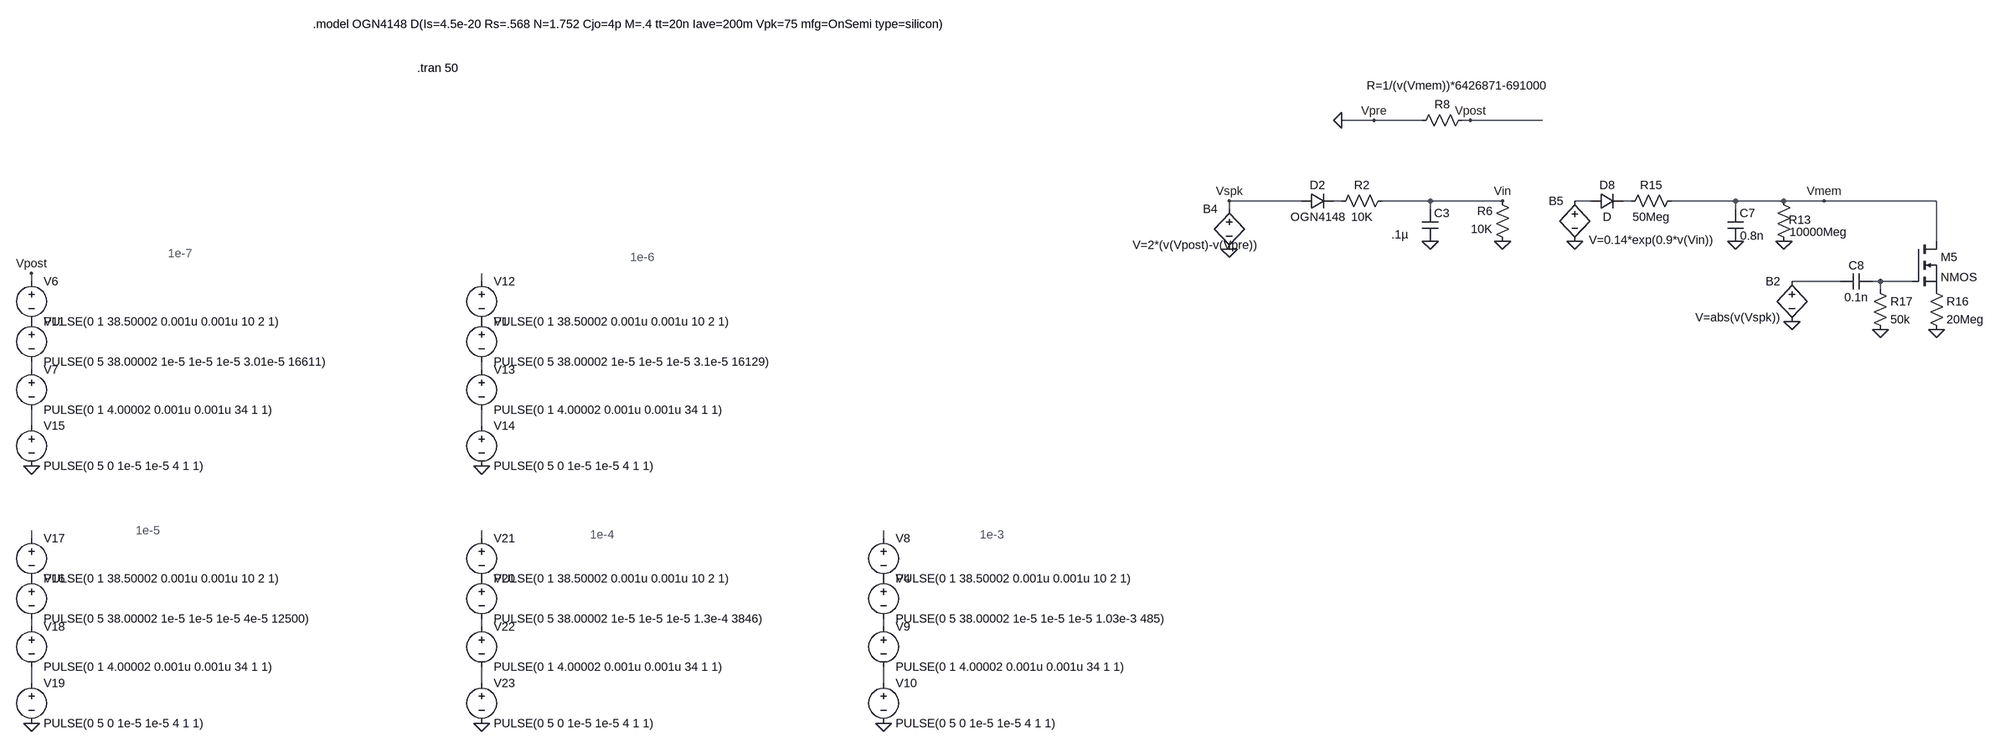
[diagram p0: schematic Synapse_Response.asc]
Synapse_Response.asc, the LTspice schematic file:
Version 4
SHEET 1 2980 2052
WIRE 240 416 176 416
WIRE 336 416 240 416
WIRE 432 416 416 416
WIRE 576 416 432 416
WIRE 96 640 -48 640
WIRE 176 640 160 640
WIRE 352 640 256 640
WIRE 496 640 352 640
WIRE 672 640 640 640
WIRE 752 640 736 640
WIRE 960 640 832 640
WIRE 1056 640 960 640
WIRE 1136 640 1056 640
WIRE 1360 640 1136 640
WIRE -48 656 -48 640
WIRE 352 656 352 640
WIRE 960 656 960 640
WIRE 1360 720 1360 640
WIRE -2432 800 -2432 784
WIRE -1536 800 -1536 784
WIRE 1168 800 1072 800
WIRE 1248 800 1232 800
WIRE 1312 800 1248 800
WIRE 1248 816 1248 800
WIRE -2432 976 -2432 960
WIRE -1536 976 -1536 960
WIRE -2432 1088 -2432 1056
WIRE -1536 1088 -1536 1056
WIRE -2432 1312 -2432 1296
WIRE -1536 1312 -1536 1296
WIRE -736 1312 -736 1296
WIRE -2432 1488 -2432 1472
WIRE -1536 1488 -1536 1472
WIRE -736 1488 -736 1472
WIRE -2432 1600 -2432 1568
WIRE -1536 1600 -1536 1568
WIRE -736 1600 -736 1568
FLAG -48 736 0
FLAG 432 416 Vpost
FLAG 352 720 0
FLAG 496 720 0
FLAG -736 1680 0
FLAG 496 640 Vin
FLAG -2432 1168 0
FLAG -48 640 Vspk
FLAG 176 416 0
FLAG -2432 784 Vpost
FLAG 240 416 Vpre
FLAG -1536 1168 0
FLAG -2432 1680 0
FLAG -1536 1680 0
FLAG 1072 880 0
FLAG 1056 720 0
FLAG 960 720 0
FLAG 640 720 0
FLAG 1360 896 0
FLAG 1248 896 0
FLAG 1136 640 Vmem
SYMBOL res 512 736 R180
WINDOW 0 36 76 Left 2
WINDOW 3 36 40 Left 2
SYMATTR InstName R6
SYMATTR Value 10K
SYMBOL bv -48 640 R0
WINDOW 0 -52 16 Left 2
WINDOW 3 -192 88 Left 2
SYMATTR InstName B4
SYMATTR Value V=2*(v(Vpost)-v(Vpre))
SYMBOL res 432 400 R90
WINDOW 0 0 56 VBottom 2
WINDOW 3 -69 27 VTop 2
SYMATTR InstName R8
SYMATTR Value R=1/(v(Vmem))*6426871-691000
SYMBOL cap 336 656 R0
WINDOW 3 -61 51 Left 2
SYMATTR Value .1µ
SYMATTR InstName C3
SYMATTR SpiceLine V=16 Irms=7.41 Rser=0.000 Lser=0
SYMBOL voltage -736 1376 R0
WINDOW 123 0 0 Left 2
WINDOW 39 0 0 Left 2
SYMATTR InstName V4
SYMATTR Value PULSE(0 5 38.00002 1e-5 1e-5 1e-5 1.03e-3 485)
SYMBOL voltage -736 1296 R0
WINDOW 123 0 0 Left 2
WINDOW 39 0 0 Left 2
SYMATTR InstName V8
SYMATTR Value PULSE(0 1 38.50002 0.001u 0.001u 10 2 1)
SYMBOL voltage -736 1472 R0
WINDOW 123 0 0 Left 2
WINDOW 39 0 0 Left 2
SYMATTR InstName V9
SYMATTR Value PULSE(0 1 4.00002 0.001u 0.001u 34 1 1)
SYMBOL voltage -736 1584 R0
WINDOW 123 0 0 Left 2
WINDOW 39 0 0 Left 2
SYMATTR InstName V10
SYMATTR Value PULSE(0 5 0 1e-5 1e-5 4 1 1)
SYMBOL res 272 624 R90
WINDOW 0 0 56 VBottom 2
WINDOW 3 32 56 VTop 2
SYMATTR InstName R2
SYMATTR Value 10K
SYMBOL voltage -2432 864 R0
WINDOW 123 0 0 Left 2
WINDOW 39 0 0 Left 2
SYMATTR InstName V11
SYMATTR Value PULSE(0 5 38.00002 1e-5 1e-5 1e-5 3.01e-5 16611)
SYMBOL voltage -2432 784 R0
WINDOW 123 0 0 Left 2
WINDOW 39 0 0 Left 2
SYMATTR InstName V6
SYMATTR Value PULSE(0 1 38.50002 0.001u 0.001u 10 2 1)
SYMBOL voltage -2432 960 R0
WINDOW 123 0 0 Left 2
WINDOW 39 0 0 Left 2
SYMATTR InstName V7
SYMATTR Value PULSE(0 1 4.00002 0.001u 0.001u 34 1 1)
SYMBOL voltage -2432 1072 R0
WINDOW 123 0 0 Left 2
WINDOW 39 0 0 Left 2
SYMATTR InstName V15
SYMATTR Value PULSE(0 5 0 1e-5 1e-5 4 1 1)
SYMBOL voltage -1536 864 R0
WINDOW 123 0 0 Left 2
WINDOW 39 0 0 Left 2
SYMATTR InstName V1
SYMATTR Value PULSE(0 5 38.00002 1e-5 1e-5 1e-5 3.1e-5 16129)
SYMBOL voltage -1536 784 R0
WINDOW 123 0 0 Left 2
WINDOW 39 0 0 Left 2
SYMATTR InstName V12
SYMATTR Value PULSE(0 1 38.50002 0.001u 0.001u 10 2 1)
SYMBOL voltage -1536 960 R0
WINDOW 123 0 0 Left 2
WINDOW 39 0 0 Left 2
SYMATTR InstName V13
SYMATTR Value PULSE(0 1 4.00002 0.001u 0.001u 34 1 1)
SYMBOL voltage -1536 1072 R0
WINDOW 123 0 0 Left 2
WINDOW 39 0 0 Left 2
SYMATTR InstName V14
SYMATTR Value PULSE(0 5 0 1e-5 1e-5 4 1 1)
SYMBOL voltage -2432 1376 R0
WINDOW 123 0 0 Left 2
WINDOW 39 0 0 Left 2
SYMATTR InstName V16
SYMATTR Value PULSE(0 5 38.00002 1e-5 1e-5 1e-5 4e-5 12500)
SYMBOL voltage -2432 1296 R0
WINDOW 123 0 0 Left 2
WINDOW 39 0 0 Left 2
SYMATTR InstName V17
SYMATTR Value PULSE(0 1 38.50002 0.001u 0.001u 10 2 1)
SYMBOL voltage -2432 1472 R0
WINDOW 123 0 0 Left 2
WINDOW 39 0 0 Left 2
SYMATTR InstName V18
SYMATTR Value PULSE(0 1 4.00002 0.001u 0.001u 34 1 1)
SYMBOL voltage -2432 1584 R0
WINDOW 123 0 0 Left 2
WINDOW 39 0 0 Left 2
SYMATTR InstName V19
SYMATTR Value PULSE(0 5 0 1e-5 1e-5 4 1 1)
SYMBOL voltage -1536 1376 R0
WINDOW 123 0 0 Left 2
WINDOW 39 0 0 Left 2
SYMATTR InstName V20
SYMATTR Value PULSE(0 5 38.00002 1e-5 1e-5 1e-5 1.3e-4 3846)
SYMBOL voltage -1536 1296 R0
WINDOW 123 0 0 Left 2
WINDOW 39 0 0 Left 2
SYMATTR InstName V21
SYMATTR Value PULSE(0 1 38.50002 0.001u 0.001u 10 2 1)
SYMBOL voltage -1536 1472 R0
WINDOW 123 0 0 Left 2
WINDOW 39 0 0 Left 2
SYMATTR InstName V22
SYMATTR Value PULSE(0 1 4.00002 0.001u 0.001u 34 1 1)
SYMBOL voltage -1536 1584 R0
WINDOW 123 0 0 Left 2
WINDOW 39 0 0 Left 2
SYMATTR InstName V23
SYMATTR Value PULSE(0 5 0 1e-5 1e-5 4 1 1)
SYMBOL bv 1072 784 R0
WINDOW 0 -52 16 Left 2
WINDOW 3 -192 88 Left 2
SYMATTR InstName B2
SYMATTR Value V=abs(v(Vspk))
SYMBOL cap 944 656 R0
WINDOW 3 25 53 Left 2
SYMATTR Value 0.8n
SYMATTR InstName C7
SYMATTR SpiceLine V=16 Irms=7.41 Rser=0.000 Lser=0
SYMBOL res 1072 736 R180
WINDOW 0 -38 58 Left 2
WINDOW 3 -110 34 Left 2
SYMATTR InstName R13
SYMATTR Value 10000Meg
SYMBOL res 848 624 R90
WINDOW 0 0 56 VBottom 2
WINDOW 3 32 56 VTop 2
SYMATTR InstName R15
SYMATTR Value 50Meg
SYMBOL bv 640 624 R0
WINDOW 0 -52 16 Left 2
WINDOW 3 28 94 Left 2
SYMATTR InstName B5
SYMATTR Value V=0.14*exp(0.9*v(Vin))
SYMBOL nmos 1312 720 R0
SYMATTR InstName M5
SYMBOL res 1344 800 R0
SYMATTR InstName R16
SYMATTR Value 20Meg
SYMBOL cap 1232 784 R90
WINDOW 0 0 32 VBottom 2
WINDOW 3 32 32 VTop 2
SYMATTR InstName C8
SYMATTR Value 0.1n
SYMBOL res 1232 800 R0
SYMATTR InstName R17
SYMATTR Value 50k
SYMBOL diode 96 656 R270
WINDOW 0 32 32 VTop 2
WINDOW 3 0 32 VBottom 2
SYMATTR InstName D2
SYMATTR Value OGN4148
SYMBOL diode 672 656 R270
WINDOW 0 32 32 VTop 2
WINDOW 3 0 32 VBottom 2
SYMATTR InstName D8
TEXT -1664 312 Left 2 !.tran 50
TEXT -1872 224 Left 2 !.model OGN4148 D(Is=4.5e-20 Rs=.568 N=1.752 Cjo=4p M=.4 tt=20n Iave=200m Vpk=75 mfg=OnSemi type=silicon)
TEXT -2160 744 Left 2 ;1e-7
TEXT -1240 752 Left 2 ;1e-6
TEXT -2224 1296 Left 2 ;1e-5
TEXT -1320 1304 Left 2 ;1e-4
TEXT -544 1304 Left 2 ;1e-3

The netlist it stands for:
* Synapse_Response.asc
R6 0 Vin 10K
B4 Vspk 0 V=2*(v(Vpost)-v(Vpre))
R8 Vpost 0 R=1/(v(Vmem))*6426871-691000
C3 Vin 0 .1µ V=16 Irms=7.41 Rser=0.000 Lser=0
V4 P001 N016 PULSE(0 5 38.00002 1e-5 1e-5 1e-5 1.03e-3 485)
V8 N013 P001 PULSE(0 1 38.50002 0.001u 0.001u 10 2 1)
V9 N016 N019 PULSE(0 1 4.00002 0.001u 0.001u 34 1 1)
V10 N019 0 PULSE(0 5 0 1e-5 1e-5 4 1 1)
R2 Vin N001 10K
V11 P002 N007 PULSE(0 5 38.00002 1e-5 1e-5 1e-5 3.01e-5 16611)
V6 Vpost P002 PULSE(0 1 38.50002 0.001u 0.001u 10 2 1)
V7 N007 N009 PULSE(0 1 4.00002 0.001u 0.001u 34 1 1)
V15 N009 0 PULSE(0 5 0 1e-5 1e-5 4 1 1)
V1 P003 N008 PULSE(0 5 38.00002 1e-5 1e-5 1e-5 3.1e-5 16129)
V12 N004 P003 PULSE(0 1 38.50002 0.001u 0.001u 10 2 1)
V13 N008 N010 PULSE(0 1 4.00002 0.001u 0.001u 34 1 1)
V14 N010 0 PULSE(0 5 0 1e-5 1e-5 4 1 1)
V16 P004 N014 PULSE(0 5 38.00002 1e-5 1e-5 1e-5 4e-5 12500)
V17 N011 P004 PULSE(0 1 38.50002 0.001u 0.001u 10 2 1)
V18 N014 N017 PULSE(0 1 4.00002 0.001u 0.001u 34 1 1)
V19 N017 0 PULSE(0 5 0 1e-5 1e-5 4 1 1)
V20 P005 N015 PULSE(0 5 38.00002 1e-5 1e-5 1e-5 1.3e-4 3846)
V21 N012 P005 PULSE(0 1 38.50002 0.001u 0.001u 10 2 1)
V22 N015 N018 PULSE(0 1 4.00002 0.001u 0.001u 34 1 1)
V23 N018 0 PULSE(0 5 0 1e-5 1e-5 4 1 1)
B2 N005 0 V=abs(v(Vspk))
C7 Vmem 0 0.8n V=16 Irms=7.41 Rser=0.000 Lser=0
R13 0 Vmem 10000Meg
R15 Vmem N003 50Meg
B5 N002 0 V=0.14*exp(0.9*v(Vin))
M5 Vmem N006 P006 P006 NMOS
R16 P006 0 20Meg
C8 N006 N005 0.1n
R17 N006 0 50k
D2 Vspk N001 OGN4148
D8 N002 N003 D
.model D D
.lib standard.dio
.model NMOS NMOS
.model PMOS PMOS
.lib standard.mos
.tran 50
.model OGN4148 D(Is=4.5e-20 Rs=.568 N=1.752 Cjo=4p M=.4 tt=20n Iave=200m Vpk=75 mfg=OnSemi type=silicon)
* 1e-7
* 1e-6
* 1e-5
* 1e-4
* 1e-3
.backanno
.end